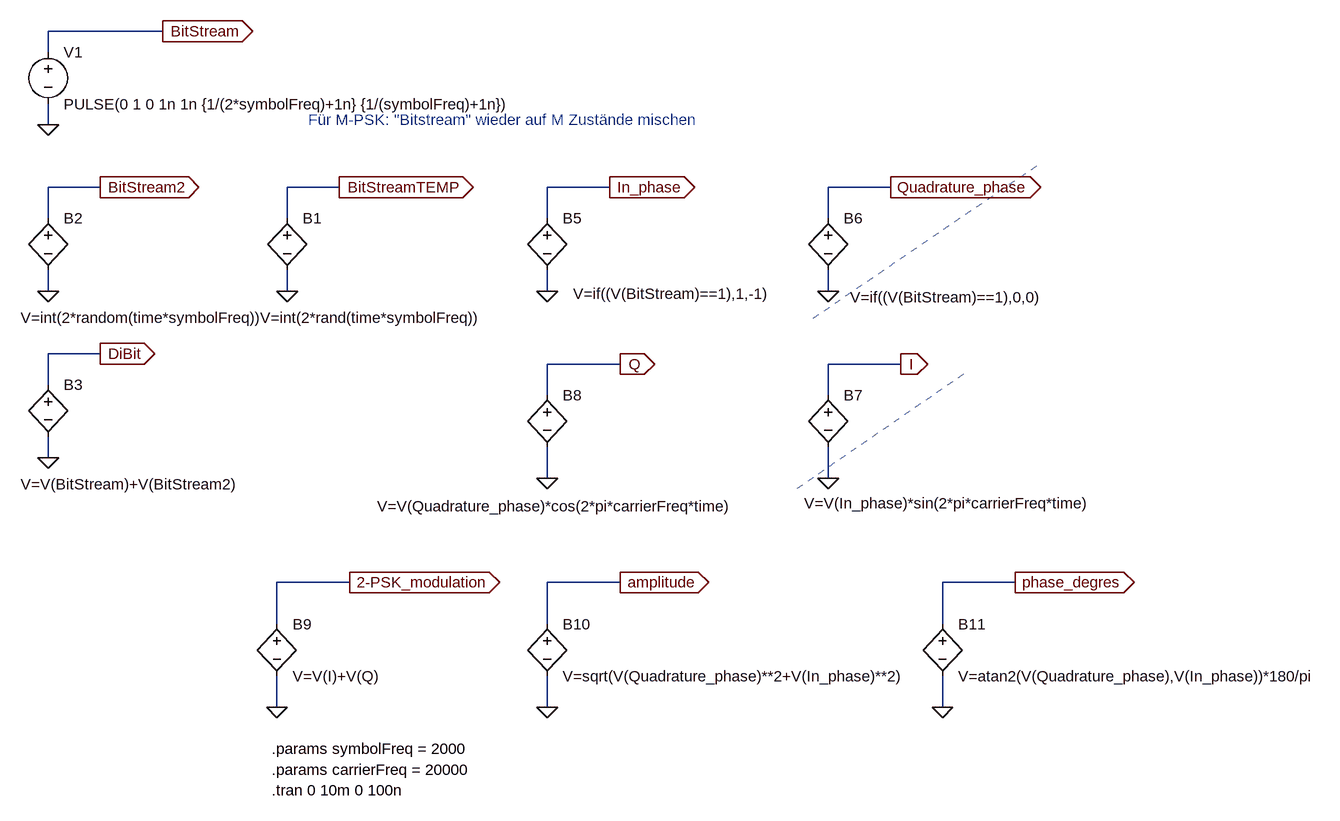
[diagram p0: schematic modulation_2psk_ltspice.asc]
modulation_2psk_ltspice.asc, the LTspice schematic file:
Version 4
SHEET 1 3708 1636
WIRE -144 -144 -320 -144
WIRE -320 -112 -320 -144
WIRE -320 0 -320 -32
WIRE -240 96 -320 96
WIRE 128 96 48 96
WIRE 544 96 448 96
WIRE 976 96 880 96
WIRE -320 144 -320 96
WIRE 48 144 48 96
WIRE 448 144 448 96
WIRE 880 144 880 96
WIRE -320 256 -320 224
WIRE 48 256 48 224
WIRE 448 256 448 224
WIRE 880 256 880 224
WIRE -240 352 -320 352
WIRE 560 368 448 368
WIRE 992 368 880 368
WIRE -320 400 -320 352
WIRE 448 416 448 368
WIRE 880 416 880 368
WIRE -320 512 -320 480
WIRE 448 544 448 496
WIRE 880 544 880 496
WIRE 144 704 32 704
WIRE 560 704 448 704
WIRE 1168 704 1056 704
WIRE 32 768 32 704
WIRE 448 768 448 704
WIRE 1056 768 1056 704
WIRE 32 896 32 848
WIRE 448 896 448 848
WIRE 1056 896 1056 848
FLAG 48 256 0
FLAG 128 96 BitStreamTEMP
IOPIN 128 96 Out
FLAG 448 256 0
FLAG 544 96 In_phase
IOPIN 544 96 Out
FLAG 976 96 Quadrature_phase
IOPIN 976 96 Out
FLAG 880 256 0
FLAG 992 368 I
IOPIN 992 368 Out
FLAG 448 544 0
FLAG 560 368 Q
IOPIN 560 368 Out
FLAG 32 896 0
FLAG 144 704 2-PSK_modulation
IOPIN 144 704 Out
FLAG 880 544 0
FLAG 448 896 0
FLAG 560 704 amplitude
IOPIN 560 704 Out
FLAG 1056 896 0
FLAG 1168 704 phase_degres
IOPIN 1168 704 Out
FLAG -320 256 0
FLAG -240 96 BitStream2
IOPIN -240 96 Out
FLAG -320 512 0
FLAG -240 352 DiBit
IOPIN -240 352 Out
FLAG -320 0 0
FLAG -144 -144 BitStream
IOPIN -144 -144 Out
SYMBOL bv 48 128 R0
WINDOW 3 -42 169 Left 2
SYMATTR Value V=int(2*rand(time*symbolFreq))
SYMATTR InstName B1
SYMBOL bv 448 128 R0
WINDOW 3 40 132 Left 2
SYMATTR Value V=if((V(BitStream)==1),1,-1)
SYMATTR InstName B5
SYMBOL bv 880 128 R0
WINDOW 3 34 137 Left 2
SYMATTR Value V=if((V(BitStream)==1),0,0)
SYMATTR InstName B6
SYMBOL bv 880 400 R0
WINDOW 3 -37 182 Left 2
SYMATTR Value V=V(In_phase)*sin(2*pi*carrierFreq*time)
SYMATTR InstName B7
SYMBOL bv 448 400 R0
WINDOW 3 -262 187 Left 2
SYMATTR Value V=V(Quadrature_phase)*cos(2*pi*carrierFreq*time)
SYMATTR InstName B8
SYMBOL bv 32 752 R0
SYMATTR InstName B9
SYMATTR Value V=V(I)+V(Q)
SYMBOL bv 448 752 R0
SYMATTR InstName B10
SYMATTR Value V=sqrt(V(Quadrature_phase)**2+V(In_phase)**2)
SYMBOL bv 1056 752 R0
SYMATTR InstName B11
SYMATTR Value V=atan2(V(Quadrature_phase),V(In_phase))*180/pi
SYMBOL bv -320 128 R0
WINDOW 3 -42 169 Left 2
SYMATTR Value V=int(2*random(time*symbolFreq))
SYMATTR InstName B2
SYMBOL bv -320 384 R0
WINDOW 3 -42 169 Left 2
SYMATTR Value V=V(BitStream)+V(BitStream2)
SYMATTR InstName B3
SYMBOL voltage -320 -128 R0
WINDOW 123 0 0 Left 2
WINDOW 39 0 0 Left 2
SYMATTR InstName V1
SYMATTR Value PULSE(0 1 0 1n 1n {1/(2*symbolFreq)+1n} {1/(symbolFreq)+1n})
TEXT 24 1024 Left 2 !.tran 0 10m 0 100n
TEXT 24 960 Left 2 !.params symbolFreq = 2000
TEXT 24 992 Left 2 !.params carrierFreq = 20000
TEXT 80 -8 Left 2 ;Für M-PSK: "Bitstream" wieder auf M Zustände mischen
LINE Normal 1200 64 848 304 2
LINE Normal 1088 384 832 560 2

The netlist it stands for:
* modulation_2psk_ltspice.asc
B1 BitStreamTEMP 0 V=int(2*rand(time*symbolFreq))
B5 In_phase 0 V=if((V(BitStream)==1),1,-1)
B6 Quadrature_phase 0 V=if((V(BitStream)==1),0,0)
B7 I 0 V=V(In_phase)*sin(2*pi*carrierFreq*time)
B8 Q 0 V=V(Quadrature_phase)*cos(2*pi*carrierFreq*time)
B9 2-PSK_modulation 0 V=V(I)+V(Q)
B10 amplitude 0 V=sqrt(V(Quadrature_phase)**2+V(In_phase)**2)
B11 phase_degres 0 V=atan2(V(Quadrature_phase),V(In_phase))*180/pi
B2 BitStream2 0 V=int(2*random(time*symbolFreq))
B3 DiBit 0 V=V(BitStream)+V(BitStream2)
V1 BitStream 0 PULSE(0 1 0 1n 1n {1/(2*symbolFreq)+1n} {1/(symbolFreq)+1n})
.tran 0 10m 0 100n
.params symbolFreq = 2000
.params carrierFreq = 20000
* Für M-PSK: "Bitstream" wieder auf M Zustände mischen
.backanno
.end